# Altium schematic sheet eTag.SchDoc
size A3
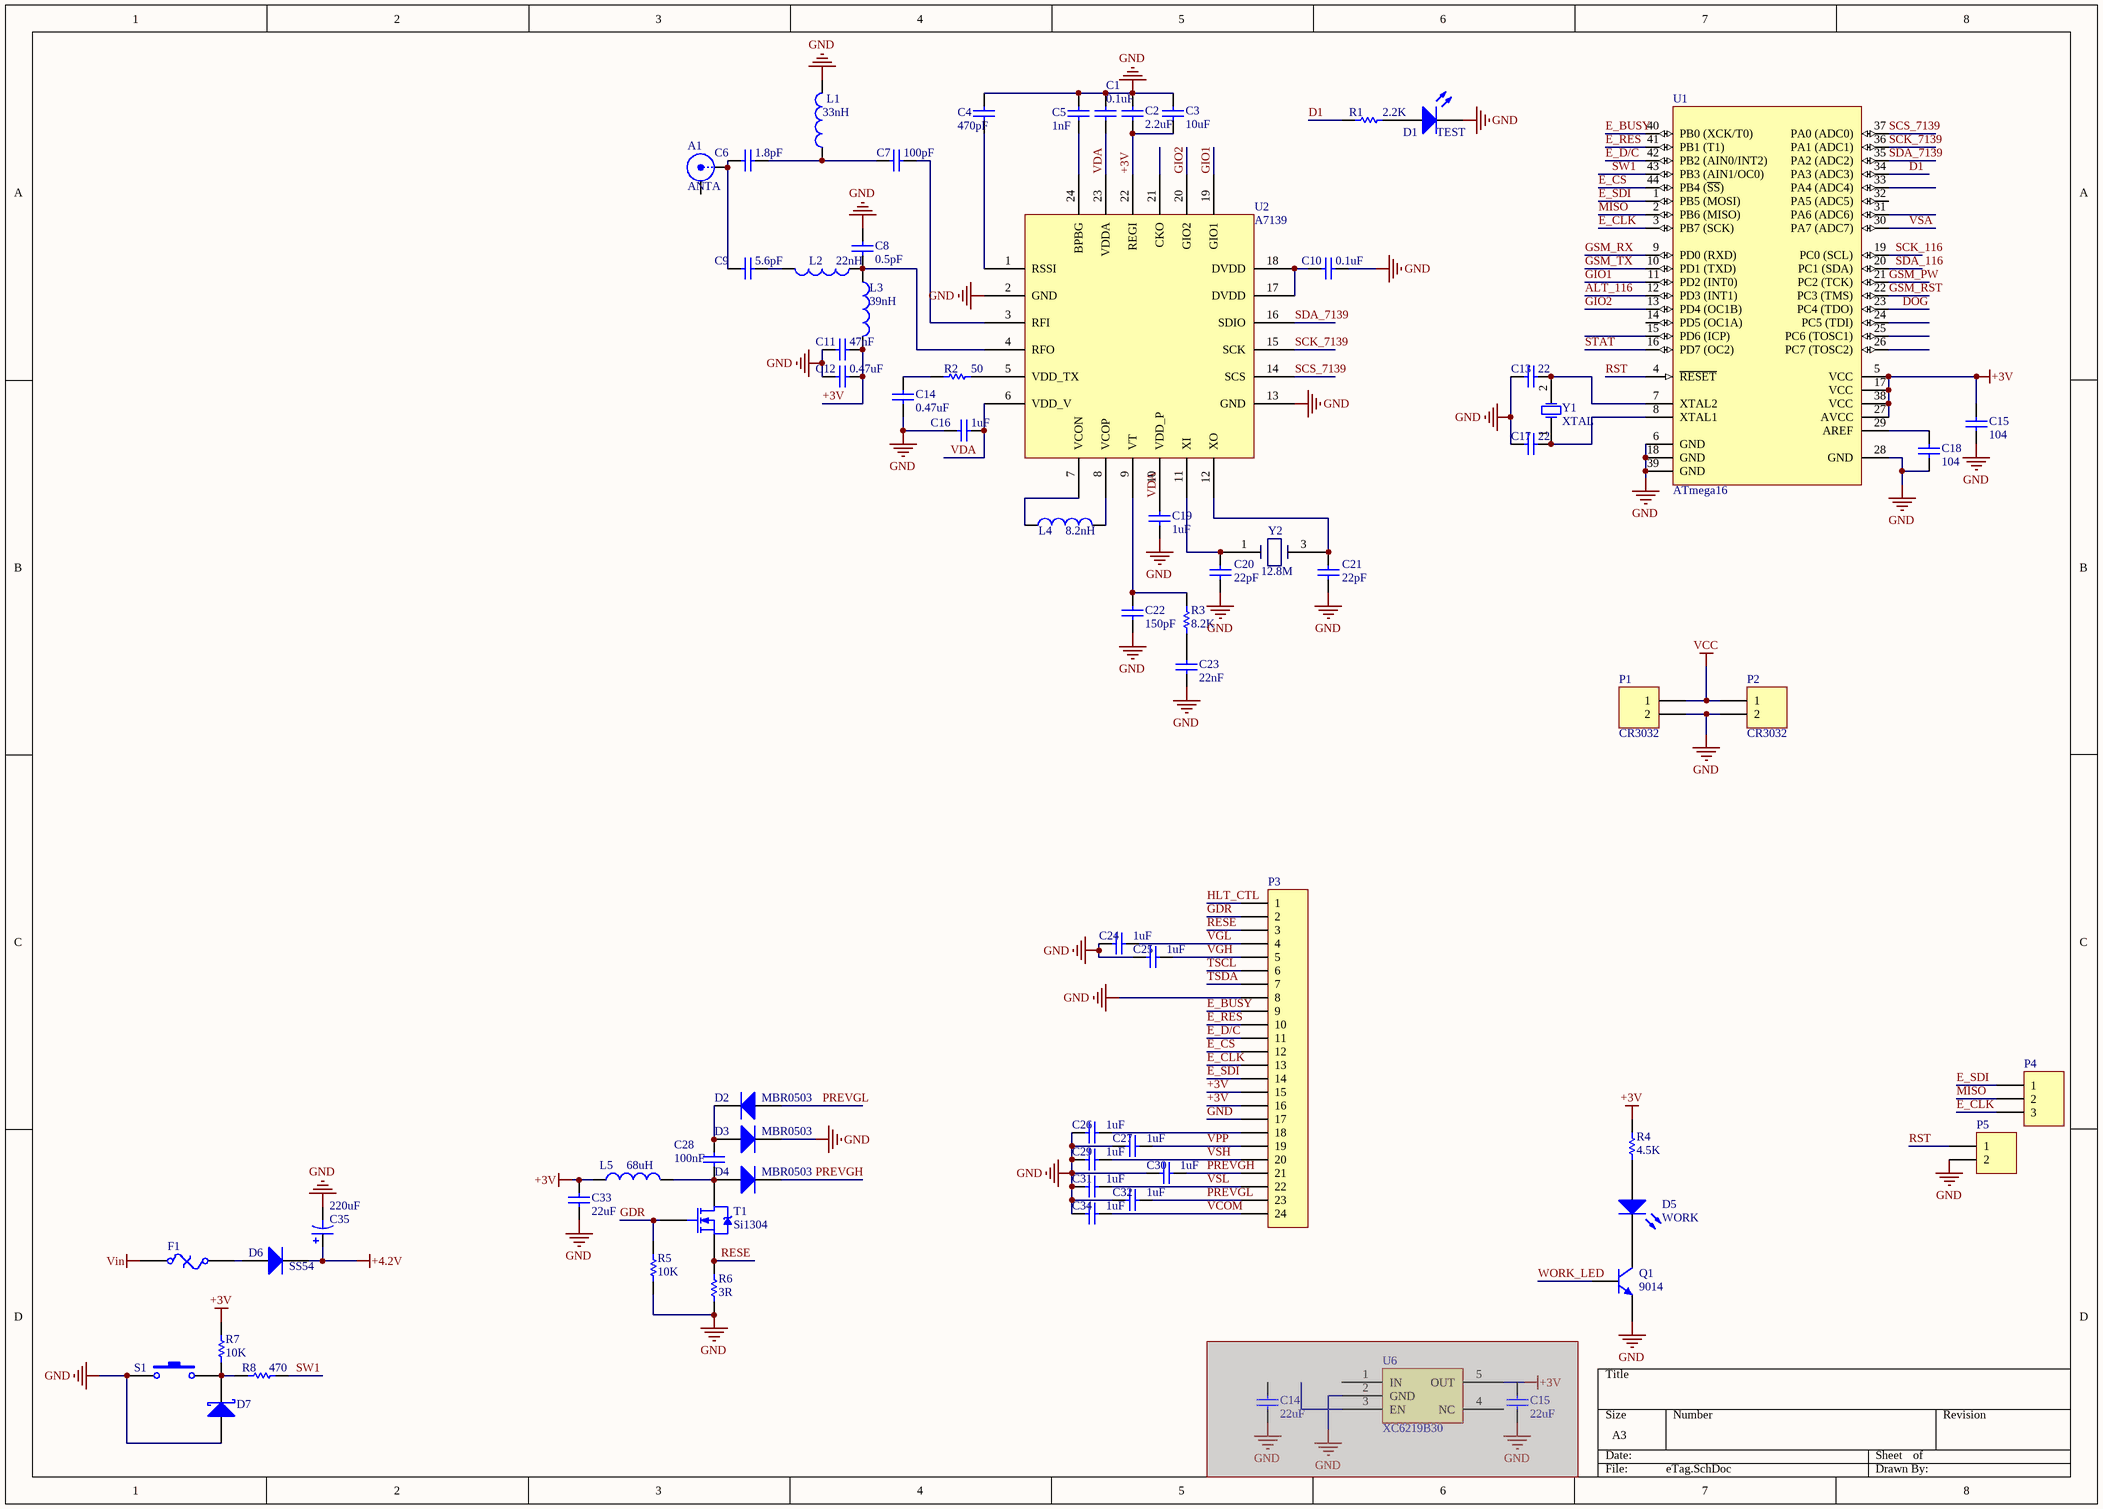
[diagram p0: eTag.SchDoc]

## Parts
(Parts that share a designator on the sheet are numbered #1, #2 ... from top to bottom, then left to right.)
A1  ANTA  [ANTA-433]
C1  value 0.1uF  [0402-A]  (hidden comment: Cap)
C2  value 2.2uF  [0603]  (hidden comment: Cap)
C3  value 10uF  [0603]  (hidden comment: Cap)
C4  value 470pF  [0402-A]  (hidden comment: Cap)
C5  value 1nF  [0402-A]  (hidden comment: Cap)
C6  value 1.8pF  [0402-A]  (hidden comment: Cap)
C7  value 100pF  [0402-A]  (hidden comment: Cap)
C8  value 0.5pF  [0402-A]  (hidden comment: Cap)
C9  value 5.6pF  [0402-A]  (hidden comment: Cap)
C10  value 0.1uF  [0402-A]  (hidden comment: Cap)
C11  value 47nF  [0402-A]  (hidden comment: Cap)
C12  value 0.47uF  [0402-A]  (hidden comment: Cap)
C13  value 22  [0603]  (hidden comment: Cap)
C14#1  value 0.47uF  [0402-A]  (hidden comment: Cap)
C14#2  value 22uF  [R0805]  (hidden comment: Cap)  (masked out: inside a compile mask, not in the netlist)
C15#1  value 104  [0603]  (hidden comment: Cap)
C15#2  value 22uF  [R0805]  (hidden comment: Cap)  (masked out: inside a compile mask, not in the netlist)
C16  value 1uF  [0402-A]  (hidden comment: Cap)
C17  value 22  [0603]  (hidden comment: Cap)
C18  value 104  [0603]  (hidden comment: Cap)
C19  value 1uF  [0402-A]  (hidden comment: Cap)
C20  value 22pF  [0402-A]  (hidden comment: Cap)
C21  value 22pF  [0402-A]  (hidden comment: Cap)
C22  value 150pF  [0402-A]  (hidden comment: Cap)
C23  value 22nF  [0402-A]  (hidden comment: Cap)
C24  value 1uF  [0603]  (hidden comment: Cap)
C25  value 1uF  [0603]  (hidden comment: Cap)
C26  value 1uF  [0603]  (hidden comment: Cap)
C27  value 1uF  [0603]  (hidden comment: Cap)
C28  value 100nF  [0603]  (hidden comment: Cap)
C29  value 1uF  [0603]  (hidden comment: Cap)
C30  value 1uF  [0603]  (hidden comment: Cap)
C31  value 1uF  [0603]  (hidden comment: Cap)
C32  value 1uF  [0603]  (hidden comment: Cap)
C33  value 22uF  [3216[1206]]  (hidden comment: Cap)
C34  value 1uF  [0603]  (hidden comment: Cap)
C35  value 220uF  [C7343]  (hidden comment: Cap Pol3)
D1  TEST  [0603-LED]
D2  MBR0503  [SOD-123]
D3  MBR0503  [SOD-123]
D4  MBR0503  [SOD-123]
D5  WORK  [0603-LED]
D6  SS54  [SMA]
D7  RL0603E012M100K  [0603]  (value not drawn)
F1  Fuse Thermal  [1812]  (value not drawn)
L1  value 33nH  [0603]  (hidden comment: Inductor)
L2  value 22nH  [0603]  (hidden comment: Inductor)
L3  value 39nH  [0603]  (hidden comment: Inductor)
L4  value 8.2nH  [0402-A]  (hidden comment: Inductor)
L5  value 68uH  [L-CD43]  (hidden comment: Inductor)
P1  CR3032  [CR3032]
P2  CR3032  [CR3032]
P3  Header 24  [FPC-24]  (value not drawn)
P4  Header 3  [HDR1X3]  (value not drawn)
P5  Header 2  [HDR1X2]  (value not drawn)
Q1  value 9014  [SOT-23-NPN]  (hidden comment: NPN)
R1  value 2.2K  [0603]  (hidden comment: Res1)
R2  value 50  [0402-A]  (hidden comment: Res1)
R3  value 8.2K  [0402-A]  (hidden comment: Res1)
R4  value 4.5K  [0603]  (hidden comment: Res1)
R5  value 10K  [0603]  (hidden comment: Res1)
R6  value 3R  [0603]  (hidden comment: Res1)
R7  value 10K  [0603]  (hidden comment: Res1)
R8  value 470  [0603]  (hidden comment: Res1)
S1  SW-PB  [SW1]  (value not drawn)
T1  Si1304  [SOT-23-NMOS]
U1  ATmega16  [44A_M]
U2  A7139  [QFN24N]
U6  XC6219B30  [SOT23-5N]  (masked out: inside a compile mask, not in the netlist)
Y1  XTAL  [XT5032]
Y2  12.8M  [XT3225]

## Nets
+3V: C2.1 C3.1 C11.2 C12.2 C15#1.1 C33.1 L3.2 L5.1 P3.15 P3.16 R4.1 R7.1 U1.5(VCC) U1.17(VCC) U1.27(AVCC) U1.38(VCC) U2.22(REGI)
+4.2V: C35.1 D6.2(K)
GND: C1.2 C2.2 C3.2 C4.2 C5.2 C8.2 C10.2 C11.1 C12.1 C13.2 C14#1.1 C15#1.2 C16.2 C17.2 C18.2 C19.1 C20.1 C21.1 C22.1 C23.2 C24.1 C25.1 C26.1 C27.1 C29.1 C30.1 C31.1 C32.1 C33.2 C34.1 C35.2 D1.2(K) D3.2(K) D7.2(A) L1.2 P1.2 P2.2 P3.8 P3.17 P5.2 Q1.1(E) R5.2 R6.2 S1.1 U1.6(GND) U1.18(GND) U1.28(GND) U1.39(GND) U2.2(GND) U2.13(GND) U2.25(GND)
VCC: P1.1 P2.1
Vin: F1.1
ALT_116: U1.12(PD3_(INT1))
D1: R1.1 U1.34(PA3_(ADC3))
DOG: U1.23(PC4_(TDO))
E_BUSY: P3.9 U1.40(PB0_(XCK/T0))
E_CLK: P3.13 P4.3 U1.3(PB7_(SCK))
E_CS: P3.12 U1.44(PB4_(~{SS}))
E_D/C: P3.11 U1.42(PB2_(AIN0/INT2))
E_RES: P3.10 U1.41(PB1_(T1))
E_SDI: P3.14 P4.1 U1.1(PB5_(MOSI))
GDR: P3.2 R5.1 T1.1(G)
GIO1: U1.11(PD2_(INT0)) U2.19(GIO1)
GIO2: U1.13(PD4_(OC1B)) U2.20(GIO2)
GSM_PW: U1.21(PC2_(TCK))
GSM_RST: U1.22(PC3_(TMS))
GSM_RX: U1.9(PD0_(RXD))
GSM_TX: U1.10(PD1_(TXD))
HLT_CTL: P3.1
MISO: P4.2 U1.2(PB6_(MISO))
PREVGH: C30.2 D4.2(K) P3.21
PREVGL: C32.2 D2.1(A) P3.23
RESE: P3.3 R6.1 T1.3(S)
RST: P5.1 U1.4(~{RESET})
SCK_116: U1.19(PC0_(SCL))
SCK_7139: U1.36(PA1_(ADC1)) U2.15(SCK)
SCS_7139: U1.37(PA0_(ADC0)) U2.14(SCS)
SDA_116: U1.20(PC1_(SDA))
SDA_7139: U1.35(PA2_(ADC2)) U2.16(SDIO)
STAT: U1.16(PD7_(OC2))
SW1: R8.2 U1.43(PB3_(AIN1/OC0))
TSCL: P3.6
TSDA: P3.7
VCOM: C34.2 P3.24
VDA: C1.1 C16.1 C19.2 U2.6(VDD_V) U2.10(VDD_P) U2.23(VDDA)
VGH: C25.2 P3.5
VGL: C24.2 P3.4
VPP: C27.2 P3.19
VSA: U1.30(PA7_(ADC7))
VSH: C29.2 P3.20
VSL: C31.2 P3.22
WORK_LED: Q1.2(B)
NetA1_1: A1.1(X) C6.2 C9.2
NetC4_1: C4.1 U2.1(RSSI)
NetC5_1: C5.1 U2.24(BPBG)
NetC6_1: C6.1 C7.2 L1.1
NetC7_1: C7.1 U2.3(RFI)
NetC8_1: C8.1 L2.1 L3.1 U2.4(RFO)
NetC9_1: C9.1 L2.2
NetC10_1: C10.1 U2.17(DVDD) U2.18(DVDD)
NetC13_1: C13.1 U1.7(XTAL2) Y1.2(OSC2)
NetC14#1_2: C14#1.2 R2.2
NetC17_1: C17.1 U1.8(XTAL1) Y1.1(OSC1)
NetC18_1: C18.1 U1.29(AREF)
NetC20_2: C20.2 U2.11(XI) Y2.1
NetC21_2: C21.2 U2.12(XO) Y2.3
NetC22_2: C22.2 R3.2 U2.9(VT)
NetC23_1: C23.1 R3.1
NetC26_2: C26.2 P3.18
NetC28_1: C28.1 D4.1(A) L5.2 T1.2(D)
NetC28_2: C28.2 D2.2(K) D3.1(A)
NetD1_1: D1.1(A) R1.2
NetD5_1: D5.1(A) R4.2
NetD5_2: D5.2(K) Q1.3(C)
NetD6_1: D6.1(A) F1.2
NetD7_1: D7.1(K) R7.2 R8.1 S1.2
NetL4_1: L4.1 U2.7(VCON)
NetL4_2: L4.2 U2.8(VCOP)
NetR2_1: R2.1 U2.5(VDD_TX)

Not connected (* = marked no-connect by the designer): A1 2(Y); U1 14(PD5_(OC1A)) 15(PD6_(ICP)) 24(PC5_(TDI)) 25(PC6_(TOSC1)) 26(PC7_(TOSC2)) 31(PA6_(ADC6)) 32(PA5_(ADC5)) 33(PA4_(ADC4)); U2 21(CKO)

## Library data of the parts
A1 = SMB: SMB Straight Connector; LatestRevisionDate: 17-Jul-2002; LatestRevisionNote: Re-released for DXP Platform.; Publisher: Altium Limited
C1-C13 C14#1 C14#2 C15#1 C15#2 C16-C34 = Cap: Capacitor; Published: 8-Jun-2000; LatestRevisionDate: 17-Jul-2002; LatestRevisionNote: Re-released for DXP Platform.; PackageReference: RAD-0.3; Publisher: Altium Limited
C35 = Cap Pol3: Polarized Capacitor (Surface Mount); Published: 8-Jun-2000; LatestRevisionDate: 17-Jul-2002; LatestRevisionNote: Re-released for DXP Platform.; PackageReference: C0805; Publisher: Altium Limited
D1 D5 = LED2: Typical RED, GREEN, YELLOW, AMBER GaAs LED; Value: GRN; Published: 8-Jun-2000; LatestRevisionDate: 17-Jul-2002; LatestRevisionNote: Re-released for DXP Platform.; PackageDocument: Feb-2002; PackageReference: 3.2X1.6X1.1; Publisher: Altium Limited
D2-D4 = Diode 1N5408: 3 Amp Medium Power Silicon Rectifier Diode; Value: SS54; Published: 8-Jun-2000; LatestRevisionDate: 17-Jul-2002; LatestRevisionNote: Re-released for DXP Platform.; DatasheetDocument: Aug-1984; PackageReference: DO-201AD; Publisher: Altium Limited; ComponentLink1Description: Manufacturer Link; ComponentLink1URL: http://www.irf.com/
D6 = Diode 1N5408: 3 Amp Medium Power Silicon Rectifier Diode; Published: 8-Jun-2000; LatestRevisionDate: 17-Jul-2002; LatestRevisionNote: Re-released for DXP Platform.; DatasheetDocument: Aug-1984; PackageReference: DO-201AD; Publisher: Altium Limited; ComponentLink1Description: Manufacturer Link; ComponentLink1URL: http://www.irf.com/; Value: SS54
D7 = Diode 18TQ045: Schottky Rectifier; Note: Terminal 2 is the TAB and is electrically connected to the cathode; Value: SMBJ45CA; Published: 8-Jun-2000; LatestRevisionDate: 17-Jul-2002; LatestRevisionNote: Re-released for DXP Platform.; DatasheetDocument: Dec-1997; PackageDocument: Feb-1998; PackageReference: TO-220AC; Publisher: Altium Limited; ComponentLink1Description: Manufacturer Link; ComponentLink1URL: http://www.irf.com/; ComponentLink2Description: Datasheet; ComponentLink2URL: http://www.irf.com/product-info/datasheets/data/18tq.pdf
F1 = Fuse Thermal: Thermal Fuse; Published: 24-Mar-1999; LatestRevisionDate: 17-Jul-2002; LatestRevisionNote: Re-released for DXP Platform.; PackageReference: PIN-W2/E2.8; Publisher: Altium Limited
L1-L5 = Inductor: Code_IEC: 1005; Published: 8-Jun-2000; LatestRevisionDate: 17-Jul-2002; LatestRevisionNote: Re-released for DXP Platform.; PackageReference: 0402-A; Publisher: Altium Limited; Code_JEITA: 0402
P1 P2 P5 = Header 2: Header, 2-Pin; LatestRevisionDate: 17-Jul-2002; LatestRevisionNote: Re-released for DXP Platform.; Publisher: Altium Limited
P3 = Header 24: Header, 24-Pin; LatestRevisionDate: 17-Jul-2002; LatestRevisionNote: Re-released for DXP Platform.; Publisher: Altium Limited
P4 = Header 3: Header, 3-Pin; LatestRevisionDate: 17-Jul-2002; LatestRevisionNote: Re-released for DXP Platform.; Publisher: Altium Limited
Q1 = 2N5551: NPN General Purpose Amplifier; Published: 8-Jun-2000; LatestRevisionDate: 17-Jan-2003; LatestRevisionNote: PCB Footprint 'BCY-W3/D4.7' replaced; DatasheetDocument: 1997; PackageDocument: Sep-1998; PackageReference: TO-92A; Publisher: Altium Limited; ComponentLink1Description: Manufacturer Link; ComponentLink1URL: http://www.fairchildsemi.com/; ComponentLink2Description: Datasheet; ComponentLink2URL: http://www.fairchildsemi.com/ds/2N%2F2N5551.pdf
R1-R8 = Res1: Resistor; Published: 8-Jun-2000; LatestRevisionDate: 17-Jul-2002; LatestRevisionNote: Re-released for DXP Platform.; PackageReference: AXIAL-0.3; Publisher: Altium Limited
S1 = SW-PB: Switch; Published: 24-Mar-1999; LatestRevisionDate: 17-Jul-2002; LatestRevisionNote: Re-released for DXP Platform.; PackageReference: SPST-2; Publisher: Altium Limited
T1 = IRF644S: HEXFET N-Channel Power MOSFET; Published: 8-Jun-2000; LatestRevisionDate: 17-Jul-2002; LatestRevisionNote: Re-released for DXP Platform.; DatasheetVersion: PD-9.1006; PackageReference: D2PAK; Publisher: Altium Limited; PackageDescription: D2-PAK/TO-263-AB; 3 Leads (1 Cropped); Body 15.5 (inc. leads) x 10.5 mm (LxW max); ComponentLink1Description: Manufacturer Link; ComponentLink1URL: http://www.irf.com/; ComponentLink2Description: Datasheet; ComponentLink2URL: http://www.irf.com/product-info/datasheets/data/irf644s.pdf
U1 = ATmega16-16AI: 8-Bit AVR Microcontroller with 16K Bytes of In-System Programmable Flash Memory; Published: 17-Sep-2003; LatestRevisionDate: 13-Apr-2006; LatestRevisionNote: IPC-7351 Footprint Added.; DatasheetVersion: 2466E-AVR-10/02; PackageVersion: rev.B, Oct-2001; PackageReference: 44A; Publisher: Altium Limited; PackageDescription: 44-Pin Thin Quad Flat Pack 0.8 mm Pitch; ComponentLink1Description: Manufacturer Link; ComponentLink1URL: http://www.atmel.com; ComponentLink2Description: Datasheet; ComponentLink2URL: http://www.atmel.com/dyn/resources/prod_documents/doc2466.pdf
U6 = LP5907: Value: LP5907
Y1 = XTAL: Crystal Oscillator; Published: 8-Jun-2000; LatestRevisionDate: 17-Jul-2002; LatestRevisionNote: Re-released for DXP Platform.; PackageReference: R38; Publisher: Altium Limited
Y2 = 3225-wy